# EAGLE design demod-breakout (EAGLE 9.6.2)
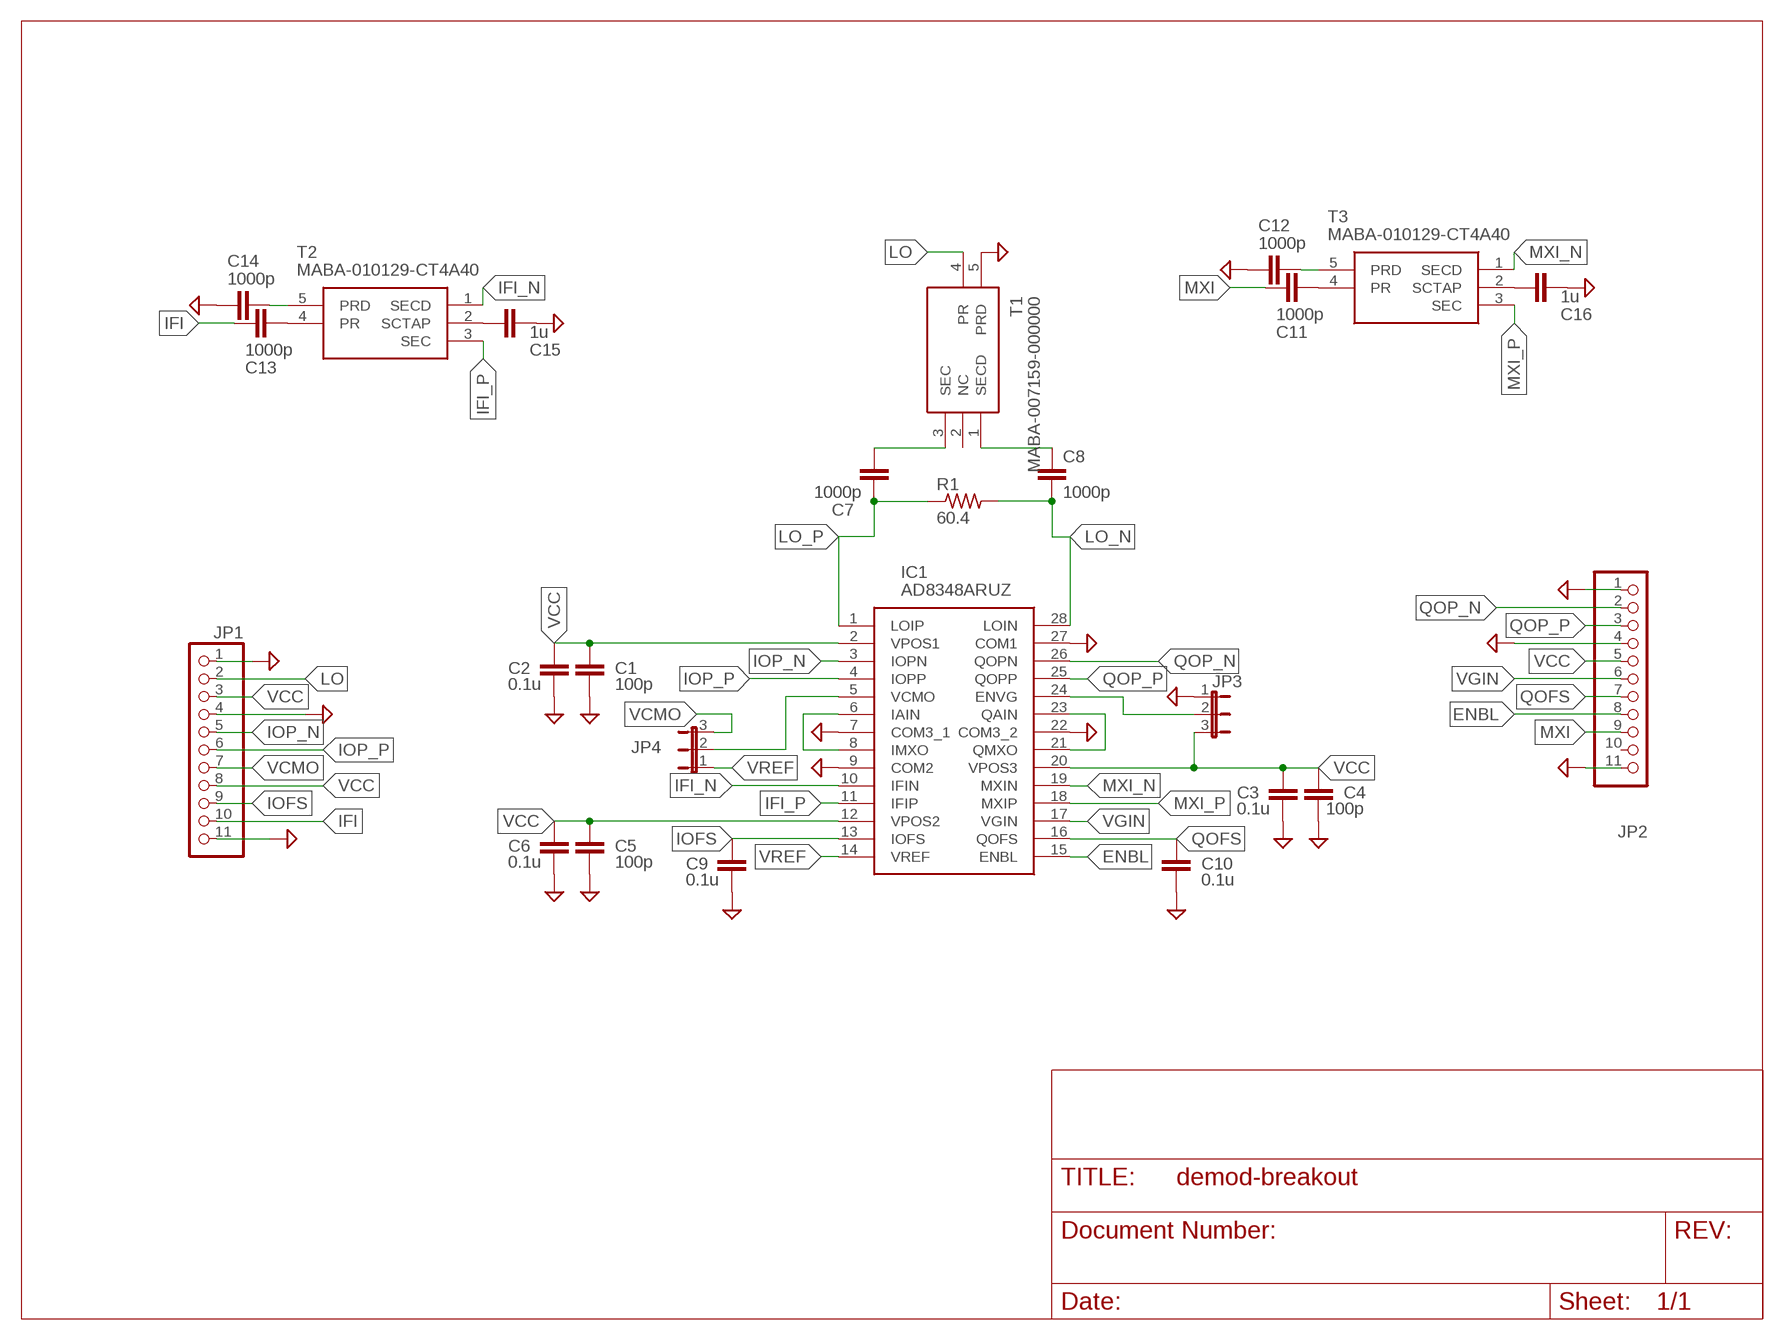
[diagram p0: schematic, sheet 1]

## Parts
C1  100p  C-EUC0402  [C0402]
C2  0.1u  C-EUC0402  [C0402]
C3  0.1u  C-EUC0402  [C0402]
C4  100p  C-EUC0402  [C0402]
C5  100p  C-EUC0402  [C0402]
C6  0.1u  C-EUC0402  [C0402]
C7  1000p  C-EUC0402  [C0402]
C8  1000p  C-EUC0402  [C0402]
C9  0.1u  C-EUC0402  [C0402]
C10  0.1u  C-EUC0402  [C0402]
C11  1000p  C-EUC0402  [C0402]
C12  1000p  C-EUC0402  [C0402]
C13  1000p  C-EUC0402  [C0402]
C14  1000p  C-EUC0402  [C0402]
C15  1u  C-EUC0603  [C0603]
C16  1u  C-EUC0603  [C0603]
IC1  AD8348ARUZ  [SOP65P640X120-28N]
JP1  PINHD-1X11  [1X11]
JP2  PINHD-1X11  [1X11]
JP3  VGA  JP2  [JP2]
JP4  VCMO  JP2  [JP2]
R1  60.4  R-US_R0402  [R0402]
T1  MABA-007159-000000  [E_SERIES_1]
T2  MABA-010129-CT4A40  [MABA010129CT4A40]
T3  MABA-010129-CT4A40  [MABA010129CT4A40]

## Nets
ENBL: IC1.15(ENBL) JP2.8
ENVG: IC1.24(ENVG) JP3.2
GND: C1.2 C2.2 C3.2 C4.2 C5.2 C6.2 C9.2 C10.2 C12.2 C14.2 C15.2 C16.2 IC1.7(COM3_1) IC1.9(COM2) IC1.22(COM3_2) IC1.27(COM1) JP1.1 JP1.4 JP1.11 JP2.1 JP2.4 JP2.11 JP3.1 T1.5(PRD)
IFI: C13.1 JP1.10
IFI_N [IFI_DPAIR]: IC1.10(IFIN) T2.1(SECD)
IFI_P [IFI_DPAIR]: IC1.11(IFIP) T2.3(SEC)
IOFS: C9.1 IC1.13(IOFS) JP1.9
IOP_N [I_DPAIR]: IC1.3(IOPN) JP1.5
IOP_P [I_DPAIR]: IC1.4(IOPP) JP1.6
LO: JP1.2 T1.4(PR)
LO_N [LO_DPAIR]: C8.2 IC1.28(LOIN) R1.2
LO_P [LO_DPAIR]: C7.2 IC1.1(LOIP) R1.1
MXI: C11.1 JP2.9
MXI_N [MXI_DPAIR]: IC1.19(MXIN) T3.1(SECD)
MXI_P [MXI_DPAIR]: IC1.18(MXIP) T3.3(SEC)
N$1: IC1.6(IAIN) IC1.8(IMXO)
N$2: IC1.21(QMXO) IC1.23(QAIN)
N$3: IC1.5(VCMO) JP4.2
N$4: C15.1 T2.2(SCTAP)
N$5: C11.2 T3.4(PR)
N$6: C7.1 T1.3(SEC)
N$7: C8.1 T1.1(SECD)
N$8: C13.2 T2.4(PR)
N$9: C14.1 T2.5(PRD)
N$10: C12.1 T3.5(PRD)
N$11: C16.1 T3.2(SCTAP)
QOFS: C10.1 IC1.16(QOFS) JP2.7
QOP_N [Q_DPAIR]: IC1.26(QOPN) JP2.2
QOP_P [Q_DPAIR]: IC1.25(QOPP) JP2.3
VCC: C1.1 C2.1 C3.1 C4.1 C5.1 C6.1 IC1.2(VPOS1) IC1.12(VPOS2) IC1.20(VPOS3) JP1.3 JP1.8 JP2.5 JP3.3
VCMO: JP1.7 JP4.3
VGIN: IC1.17(VGIN) JP2.6
VREF: IC1.14(VREF) JP4.1
Unconnected: JP2.10 T1.2(NC)

## Library data of the parts
C1-C16 = rcl:C-EU: CAPACITOR, European symbol; SPICEPREFIX: C
IC1 = SamacSys_Parts:AD8348ARUZ: AD8348ARUZ, Demodulator Quadrature 25.5dB 75MHz 28-Pin TSSOP Source: Datasheet <http://www.analog.com/static/imported-files/data_sheets/AD8348.pdf>; DESCRIPTION: AD8348ARUZ, Demodulator Quadrature 25.5dB 75MHz 28-Pin TSSOP; HEIGHT: 1.2mm; MANUFACTURER_NAME: Analog Devices; MANUFACTURER_PART_NUMBER: AD8348ARUZ; MOUSER_PART_NUMBER: 584-AD8348ARUZ; MOUSER_PRICE-STOCK: https://www.mouser.co.uk/ProductDetail/Analog-Devices/AD8348ARUZ?qs=%2FtpEQrCGXCy3u%2Fm%2FZroFwg%3D%3D
JP1 JP2 = pinhead:PINHD-1X11: PIN HEADER
JP3 JP4 = SamacSys_Parts:JP2: JUMPER
R1 = rcl:R-US_: RESISTOR, American symbol; SPICEPREFIX: R
T1 = SamacSys_Parts:MABA-007159-000000: Audio Transformers / Signal Transformers 4.5-3000MHz IL 2dB Impedance Ratio 1:1 Source: Datasheet <https://componentsearchengine.com/Datasheets/1/MABA-007159-000000.pdf>; DESCRIPTION: Audio Transformers / Signal Transformers 4.5-3000MHz IL 2dB Impedance Ratio 1:1; HEIGHT: mm; MANUFACTURER_NAME: MACOM; MANUFACTURER_PART_NUMBER: MABA-007159-000000; MOUSER_PART_NUMBER: 937-MABA007159000000; MOUSER_PRICE-STOCK: https://www.mouser.co.uk/ProductDetail/MACOM/MABA-007159-000000?qs=3Wmz%2FrCSAaFBkdkj62uXUA%3D%3D
T2 T3 = SamacSys_Parts:MABA-010129-CT4A40: Audio Transformers / Signal Transformers 50-1200MHz Imp. 1:4 50 & 75 ohm Source: Datasheet <https://componentsearchengine.com/Datasheets/1/MABA-010129-CT4A40.pdf>; DESCRIPTION: Audio Transformers / Signal Transformers 50-1200MHz Imp. 1:4 50 & 75 ohm; HEIGHT: 3.971mm; MANUFACTURER_NAME: MACOM; MANUFACTURER_PART_NUMBER: MABA-010129-CT4A40; MOUSER_PART_NUMBER: 937-MABA010129CT4A40; MOUSER_PRICE-STOCK: https://www.mouser.co.uk/ProductDetail/MACOM/MABA-010129-CT4A40?qs=b4gJvg5HYEuUsN8MGq4DRA%3D%3D

## Board
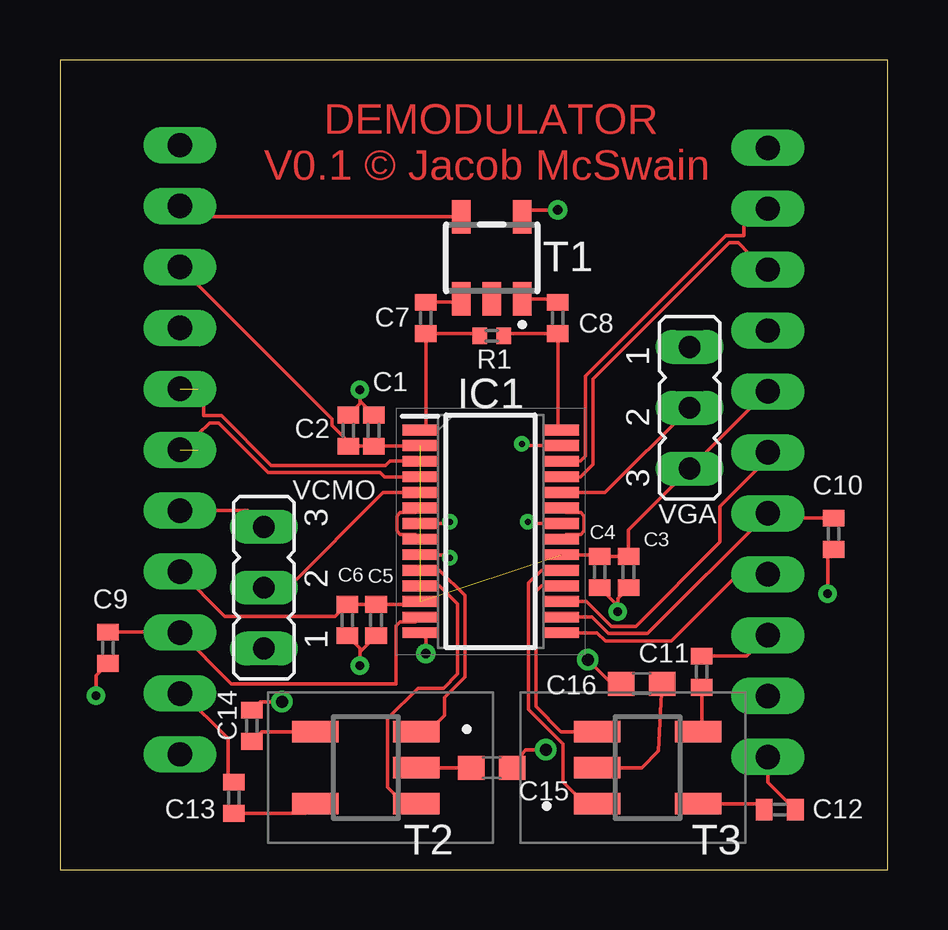
[diagram p1: board, top side]
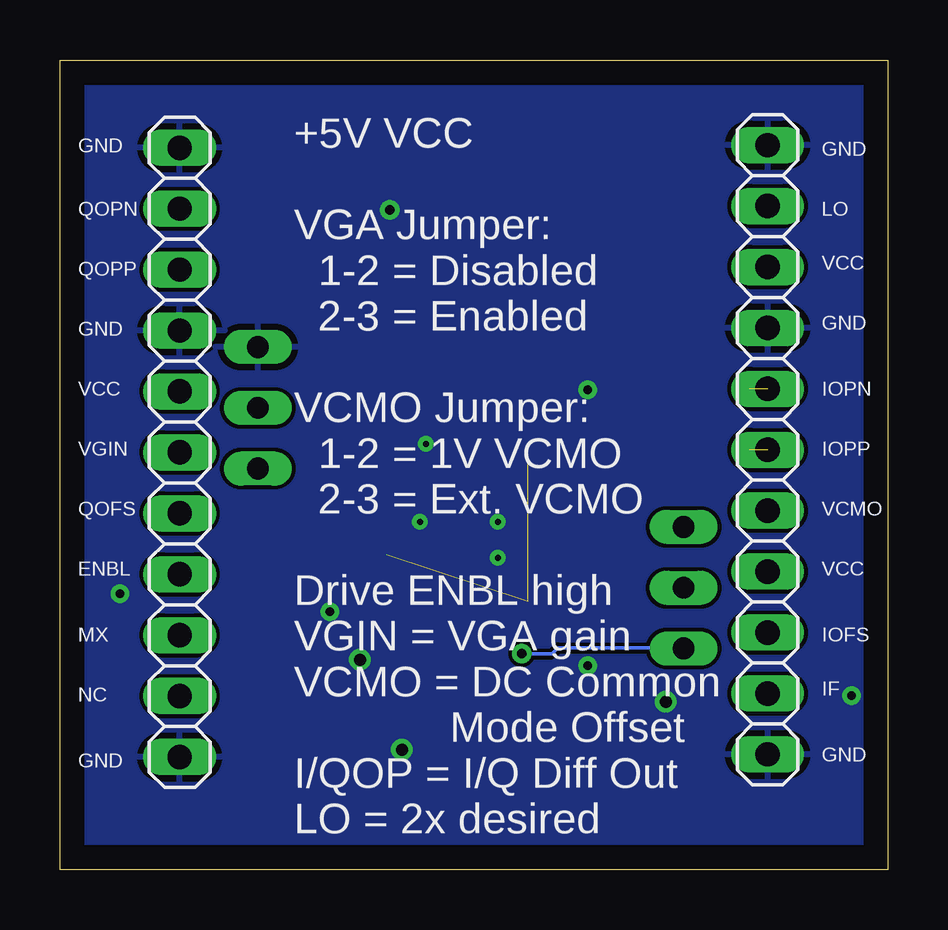
[diagram p2: board, bottom side, seen from below]

Size 34.5 x 33.75 mm. Coordinates in mm from the lower left corner, seen from the top.
Outline: 0,0 34.5,0 34.5,33.75 0,33.75 0,0
Copper layers (1*16): Top 0.035mm / dielectric 1.5mm / Bottom 0.035mm
Design rules "default": minimum track width 6mil, minimum drill 0.35mm, track to track 6mil, track to pad 6mil, pad to pad 6mil, via to via 6mil, smd to smd 6mil, copper to edge 40mil, drill to drill 6mil, minimum pad ring 10mil, minimum via ring 8mil, stop-mask expansion 4mil, vias tented up to drill 0mil, thermal gap 10mil

### Footprints (pad centres in the part's own frame; a part is rotated, then mirrored left to right if it is on the bottom)
C0402 = smd 0.7 x 0.9: 1 -0.65,0; 2 0.65,0
C0603 = smd 1.1 x 1: 1 -0.85,0; 2 0.85,0
SOP65P640X120-28N = smd 1.475 x 0.45: 1 -2.938,4.225; 2 -2.938,3.575; 3 -2.938,2.925; 4 -2.938,2.275; 5 -2.938,1.625; 6 -2.938,0.975; 7 -2.938,0.325; 8 -2.938,-0.325; 9 -2.938,-0.975; 10 -2.938,-1.625; 11 -2.938,-2.275; 12 -2.938,-2.925; 13 -2.938,-3.575; 14 -2.938,-4.225; 15 2.938,-4.225; 16 2.938,-3.575; 17 2.938,-2.925; 18 2.938,-2.275; 19 2.938,-1.625; 20 2.938,-0.975; 21 2.938,-0.325; 22 2.938,0.325; 23 2.938,0.975; 24 2.938,1.625; 25 2.938,2.275; 26 2.938,2.925; 27 2.938,3.575; 28 2.938,4.225
1X11 = drill 1.016 long: 1 -12.7,0; 2 -10.16,0; 3 -7.62,0; 4 -5.08,0; 5 -2.54,0; 6 0,0; 7 2.54,0; 8 5.08,0; 9 7.62,0; 10 10.16,0; 11 12.7,0
JP2 = drill 0.914 long: 1 -2.54,0; 2 0,0; 3 2.54,0
R0402 = smd 0.6 x 0.7: 1 -0.5,0; 2 0.5,0
E_SERIES_1 = smd 1.4 x 0.76: 1 1.715,1.27; 2 1.715,0; 3 1.715,-1.27; 4 -1.715,-1.27; 5 -1.715,1.27
MABA010129CT4A40 = smd 1.92 x 0.91: 1 2.105,1.5; 2 2.105,0; 3 2.105,-1.5; 4 -2.105,-1.5; 5 -2.105,1.5

### Placement (x,y rotation side)
C1  13.07,18.3 90 top
C2  12.03,18.3 90 top
C3  23.7,12.4 270 top
C4  22.5,12.4 270 top
C5  13.18,10.4 270 top
C6  11.97,10.4 270 top
C7  15.25,23 270 top
C8  20.75,23 270 top
C9  2,9.25 270 top
C10  32.25,14 270 top
C11  26.75,8.25 270 top
C12  30,2.5 0 top
C13  7.25,3 270 top
C14  8,6 90 top
C15  18,4.25 0 top
C16  24.25,7.75 180 top
IC1  17.95,14.1 0 top
JP1  5,17.5 270 bottom
JP2  29.51,17.39 270 bottom
JP3  26.25,19.25 270 top
JP4  8.5,11.75 90 top
R1  18,22.25 0 top
T1  18,25.5 270 top
T2  12.75,4.25 0 top
T3  24.5,4.25 180 top

### Tracks (layer width: path | path; a pad name or v marks a point on that pad's centre or on a via)
ENBL
  Top 0.152: IC1.15 22.39,9.88 22.73,9.53 25.48,9.53 28.26,12.31 JP2.8
ENVG
  Top 0.152: JP3.2 22.73,15.72 IC1.24
GND  (via drill 0.25, 0.35, 0.4, 0.5)
  Top 0.152: IC1.9 16.12,13.12 v16.25,13 | IC1.7 16.18,14.43 v16.25,14.5 | IC1.27 19.32,17.68 v19.25,17.75 | IC1.22 19.57,14.43 v19.5,14.5 | C4.2 23.25,11 v23.25,10.75 23.25,11.3 C3.2 | C6.2 12.5,9.22 v12.5,8.5 12.5,9.07 C5.2 | C2.2 12.5,19.43 v12.5,20 12.5,19.52 C1.2 | T1.5 19.55,27.5 v20.75,27.5 | C9.2 1.5,8.1 v1.5,7.25 | v32,11.5 32,13.1 C10.2 | C14.2 8.35,7 v9.25,7 | C15.2 19.4,5 v20.25,5 | C12.2 29.51,3.64 JP2.11 | C16.2 23,7.75 v22,8.75
  pour Bottom: 0,33.75 34.5,33.75 34.5,0 0,0
IFI
  Top 0.152: C13.1 7,3.9 7,5.46 5.12,7.34 JP1.10
IFI_N
  Top 0.152: IC1.10 15.83,12.47 16.88,11.42 16.88,8.02 16.04,7.18 16.04,6.43 15.36,5.75 T2.1
IFI_P
  Top 0.152: IC1.11 15.83,11.82 16.58,11.07 16.58,8.15 15.99,7.56 14.93,7.56 13.67,6.3 13.67,3.43 14.35,2.75 T2.3
IOFS
  Top 0.152: IC1.13 14.82,10.33 14.18,10.33 14,10.15 14,7.75 7.13,7.75 JP1.9 4.98,9.9 C9.1
IOP_N  (1 unrouted)
  Top 0.152: 5.76,20.04 6,19.81 6,18.92 6.74,18.92 8.81,16.85 13.58,16.85 13.76,17.02 IC1.3
IOP_P  (1 unrouted)
  Top 0.152: 5.76,17.5 5.76,18.15 6.23,18.62 6.61,18.62 8.68,16.55 13.35,16.55 13.52,16.38 IC1.4
LO
  Top 0.152: 16.59,27.36 T1.4 5.45,27.21 JP1.2
LO_N
  Top 0.152: R1.2 18.6,22.35 C8.2 20.75,18.46 IC1.28
LO_P
  Top 0.152: R1.1 17.4,22.35 C7.2 15.25,18.32 IC1.1
MXI
  Top 0.152: JP2.9 28.64,8.9 C11.1
MXI_N
  Top 0.152: IC1.19 20.07,12.47 19.54,11.94 19.54,6.67 20.98,5.24 20.98,3.66 21.89,2.75 T3.1
MXI_P
  Top 0.152: IC1.18 20.07,11.82 19.85,11.6 19.85,6.8 20.89,5.75 T3.3
N$1
  Top 0.152: IC1.6 14.82,14.88 14.18,14.88 14.05,14.74 14.05,14.11 14.18,13.97 14.82,13.97 IC1.8
N$2
  Top 0.152: IC1.21 21.08,13.97 21.72,13.97 21.85,14.11 21.85,14.74 21.72,14.88 21.08,14.88 IC1.23
N$3
  Top 0.152: JP4.2 9.5,11.75 13.47,15.72 IC1.5
N$4
  Top 0.152: T2.2 C15.1
N$5
  Top 0.152: C11.2 26.75,5.89 T3.4
N$6
  Top 0.152: T1.3 16.59,23.65 C7.1
N$7
  Top 0.152: T1.1 20.61,23.79 C8.1
N$8
  Top 0.152: C13.2 10.24,2.35 T2.4
N$9
  Top 0.152: C14.1 8.4,5.75 T2.5
N$10
  Top 0.152: T3.5 29.1,2.75 C12.1
N$11
  Top 0.152: C16.1 24.94,4.94 24.25,4.25 T3.2
QOFS
  Top 0.152: IC1.16 22.17,10.53 22.86,9.84 24.5,9.84 JP2.7 29.71,14.65 C10.1
QOP_N
  Top 0.152: IC1.26 21.7,17.02 21.91,17.23 21.91,20.57 27.77,26.43 28.51,26.43 28.51,27.32 28.75,27.55 JP2.2
QOP_P
  Top 0.152: IC1.25 21.7,16.38 22.21,16.89 22.21,20.44 27.9,26.13 28.28,26.13 28.75,25.66 28.75,25.01 JP2.3
VCC  (2 unrouted)
  Top 0.152: IC1.2 14.99,17.65 C1.1 C2.1 12.03,17.83 11.35,18.5 11.35,18.77 JP1.3 | IC1.20 22.43,13.12 C4.1 C3.1 23.7,14.16 JP3.3 29.47,19.93 JP2.5 | IC1.12 14.89,11.05 C5.1 C6.1 11.47,10.55 6.87,10.55 JP1.8
VCMO
  Top 0.152: JP1.7 7.83,14.96 JP4.3
VGIN
  Top 0.152: IC1.17 21.95,11.18 22.98,10.14 24,10.14 27.51,13.65 27.51,15.14 29.51,17.14 JP2.6
VREF  (via drill 0.4)
  Top 0.152: IC1.14 15.25,9.64 v15.25,9
  Bottom 0.152: v15.25,9 14,9 13.75,9.25 8.54,9.25 JP4.1

### Text on the board
Top: DEMODULATOR / V0.1 © Jacob McSwain
bNames: GND | GND | LO | QOPN | VCC | QOPP | GND | GND | IOPN | VCC | IOPP | VGIN | VCMO | QOFS | VCC | ENBL | IOFS | MX | IF | NC | GND | GND | +5V VCC / / VGA Jumper: / 1-2 = Disabled / 2-3 = Enabled / / VCMO Jumper: / 1-2 = 1V VCMO / 2-3 = Ext. VCMO / / Drive ENBL high / VGIN = VGA gain / VCMO = DC Common / Mode Offset / I/QOP = I/Q Diff Out / LO = 2x desired
tStop: DEMODULATOR / V0.1 © Jacob McSwain | DEMODULATOR / V0.1 © Jacob McSwain